# Altium schematic sheet MICRO SD CARD.SchDoc
size A; SheetNumber: 4; SheetTotal: 4
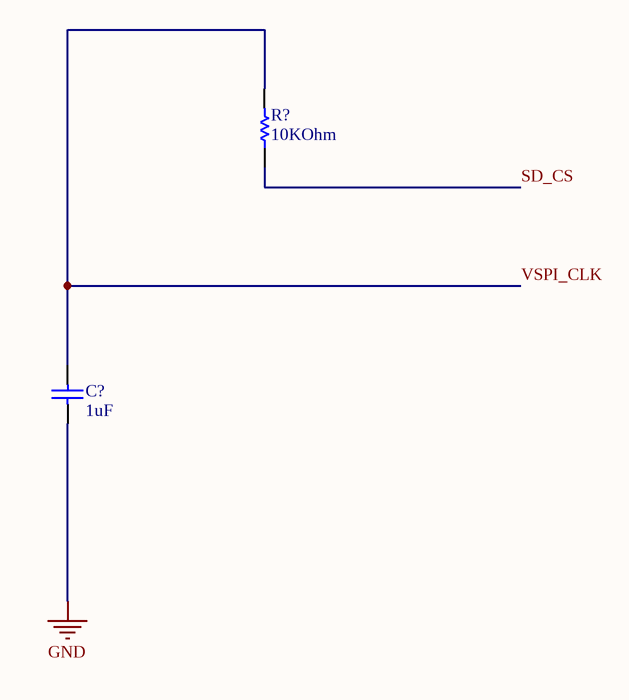
[diagram p0: MICRO SD CARD.SchDoc]

## Parts
C?  Capacitance: 1uF  [CAPC2013X145X50LL20T25]  (hidden comment: C0805C105K4PACTU)
R?  Resistance: 10KOhm  [RESC1005X40X25LL05T05]  (hidden comment: ERJ2RKF1002X)

## Nets
GND: C?.2
SD_CS: R?.1
VSPI_CLK: C?.1 R?.2

## Library data of the parts
C? = CMP-1036-04746-2: Manufacturer: Kemet; Part Number: C0805C105K4PACTU
R? = CMP-2000-07588-1: Chip Resistor, 10 KOhm, +/- 1%, 0.1 W, -55 to 155 degC, 0402 (1005 Metric), RoHS, Tape and Reel; Manufacturer: Panasonic; Power Rating: 100mW; Voltage Rating: 50V; Case\/Package: 0402; Temperature Coefficient: 100ppm\/degreesC; RoHSCompliant: True; Lead Free: LeadFree; Package Quantity: 1; Contact Plating: Tin; Length: 1mm; Radiation Hardening: No; REACH SVHC: NoSVHC; Max Operating Temperature: 155degC; Depth: 0.5mm; Case Code (Imperial): 0402; Military Standard: Not; Package Description: 2-Pin Surface Mount Device, Body 1 x 0.5 mm; Termination: SMD/SMT; Case Code (Metric): 1005; Height: 0.35mm; Packaging: TapeandReel; Voltage Rating (DC): 50V; Package Reference: 402; Number of Pins: 2; Tolerance: 1%; Mounting Technology: SurfaceMount; Width: 0.02inch; Mount: SurfaceMount; Datasheet URL: https://industrial.panasonic.com/cdbs/www-data/pdf/RDA0000/AOA0000C304.pdf; Composition: ThickFilm; Datasheet Version: 02/2017; Manufacturer URL: http://www.panasonic.com/; Max Power Dissipation: 100mW; Number of Terminations: 2; Min Operating Temperature: -55degC